# EAGLE design PowerBlock (EAGLE 5.10)
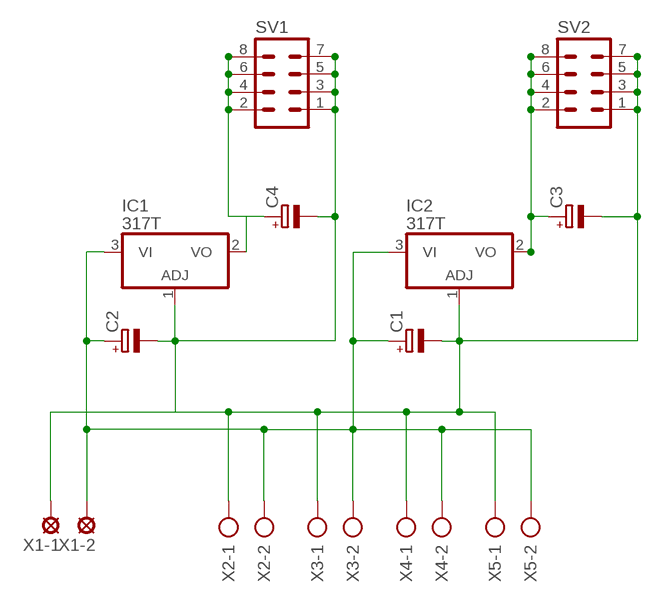
[diagram p0: schematic, sheet 1]

## Parts
C1  CPOL-EUE3.5-8  [E3,5-8]
C2  CPOL-EUE3.5-8  [E3,5-8]
C3  CPOL-EUE2.5-6  [E2,5-6]
C4  CPOL-EUE2.5-6  [E2,5-6]
IC1  317T  [TO220H]
IC2  317T  [TO220H]
SV1  MA04-2  [MA04-2]
SV2  MA04-2  [MA04-2]
X1-1  SE14  [SE14]
X1-2  SE14  [SE14]
X2  AK500/2  [AK500/2]
X3  AK500/2  [AK500/2]
X4  AK500/2  [AK500/2]
X5  AK500/2  [AK500/2]

## Nets
GND: C1.- C2.- C3.- C4.- IC1.1(ADJ) IC2.1(ADJ) SV1.1 SV1.3 SV1.5 SV1.7 SV2.1 SV2.3 SV2.5 SV2.7 X1-1.MP X2.1 X3.1 X4.1 X5.1
N$1: C4.+ IC1.2(VO) SV1.2 SV1.4 SV1.6 SV1.8
N$3: C3.+ IC2.2(VO) SV2.2 SV2.4 SV2.6 SV2.8
VCC: C1.+ C2.+ IC1.3(VI) IC2.3(VI) X1-2.MP X2.2 X3.2 X4.2 X5.2

## Library data of the parts
C1-C4 = rcl:CPOL-EU: POLARIZED CAPACITOR, European symbol
IC1 IC2 = linear:*317: Positive VOLTAGE REGULATOR
SV1 SV2 = con-lstb:MA04-2: PIN HEADER
X1-1 X1-2 = solpad:SE14: SOLDER PAD E1553, drill 1,4mm, distributor Buerklin, 07F820
X2-X5 = con-ptr500:AK500/2: CONNECTOR

## Board
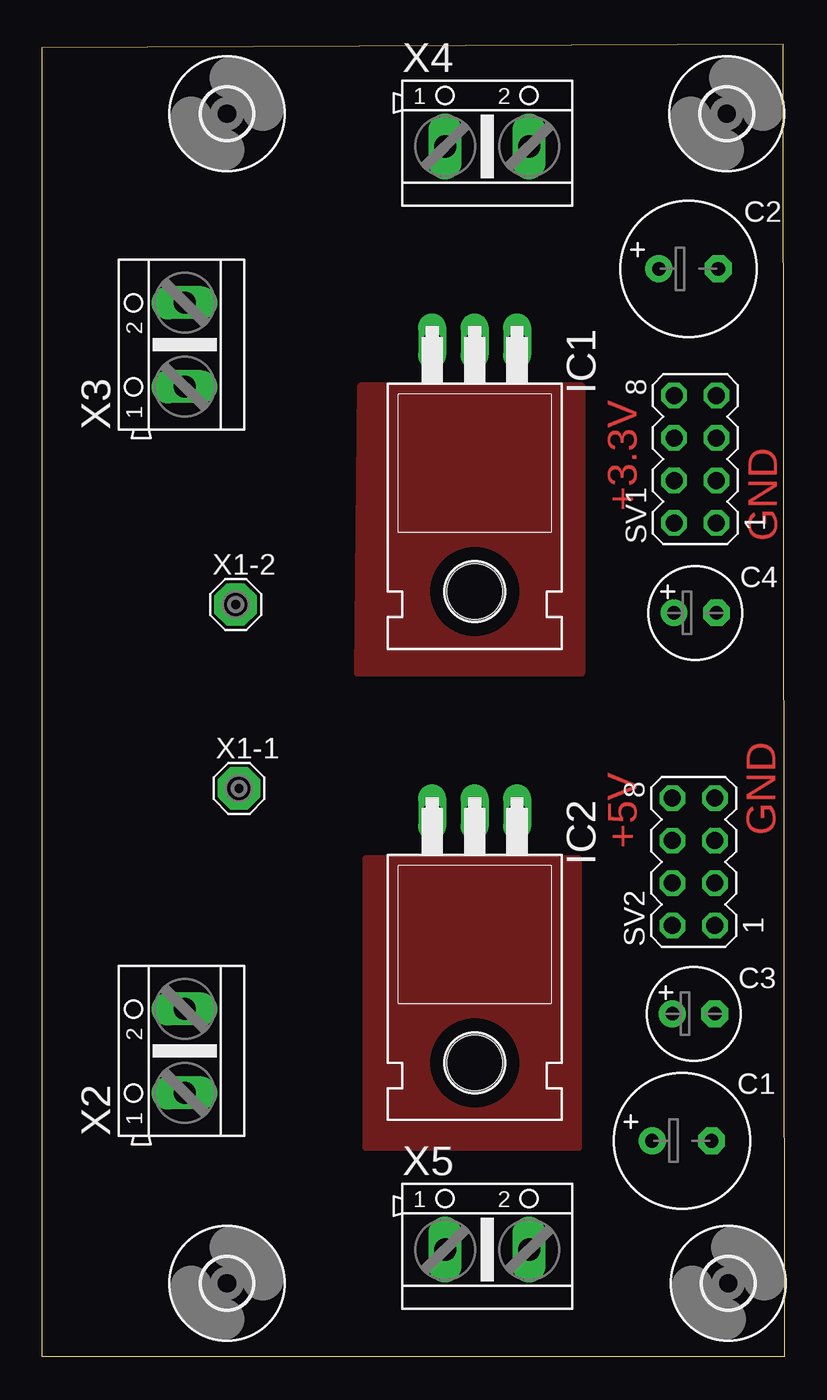
[diagram p1: board, top side]
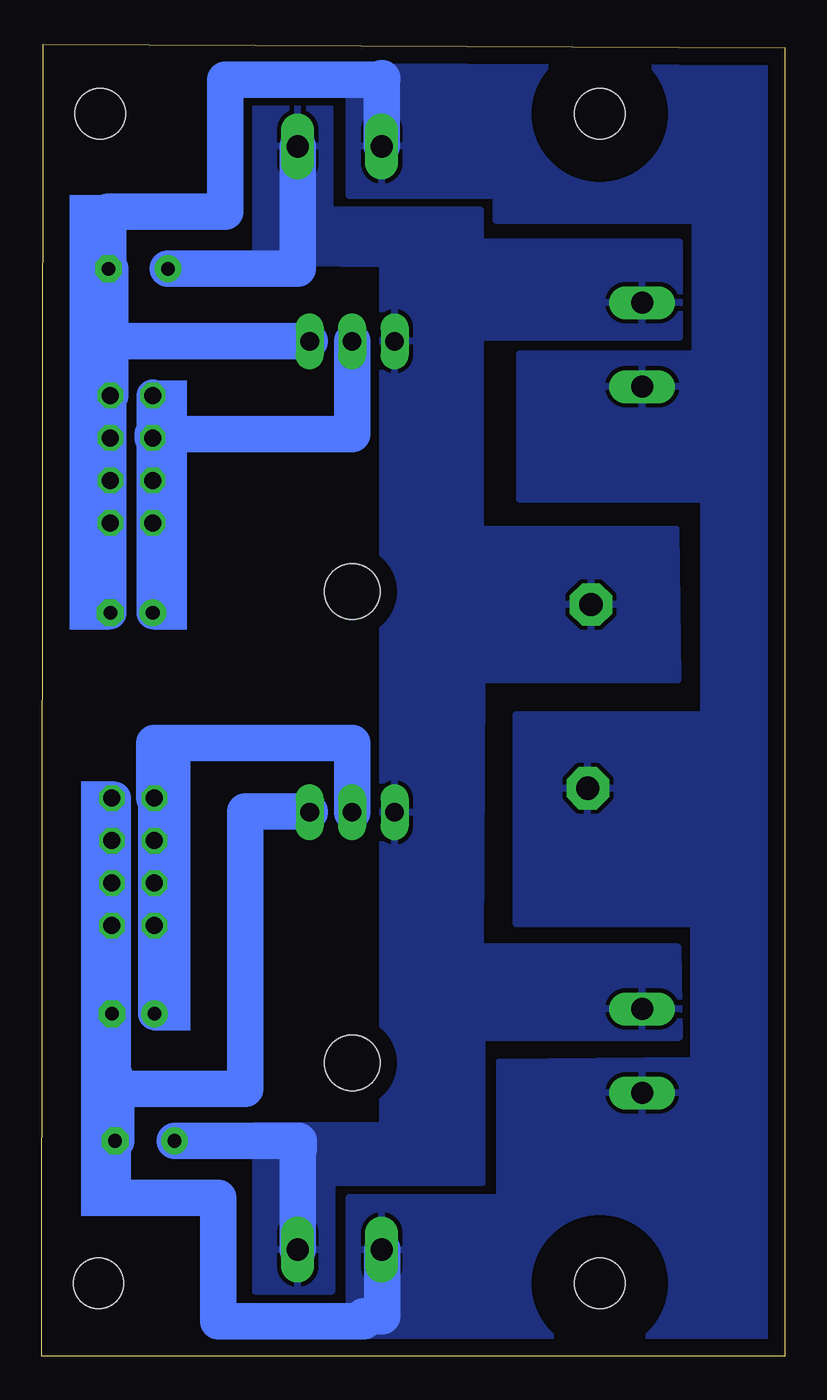
[diagram p2: board, bottom side, seen from below]

Size 44.47 x 78.54 mm. Coordinates in mm from the lower left corner, seen from the top.
Outline: 0,0 44.47,0 44.37,78.54 0,78.34 0,0
Copper layers (1*16): Top 0.035mm / dielectric 1.5mm / Bottom 0.035mm
Design rules "default": minimum track width 20mil, minimum drill 32mil, track to track 16mil, track to pad 16mil, pad to pad 16mil, via to via 16mil, smd to smd 12mil, copper to edge 40mil, drill to drill 40mil, minimum pad ring 10mil, minimum via ring 8mil, stop-mask expansion 4mil, vias tented up to drill 0mil, thermal gap 10mil

### Footprints (pad centres in the part's own frame; a part is rotated, then mirrored left to right if it is on the bottom)
E3,5-8 = drill 0.813 pad 1.6 round: + -1.778,0 | drill 0.813 pad 1.6 octagon: - 1.778,0
E2,5-6 = drill 0.813 pad 1.6 round: + -1.27,0 | drill 0.813 pad 1.6 octagon: - 1.27,0
TO220H = drill 1.118 long: 1 -2.54,-10.16; 2 0,-10.16; 3 2.54,-10.16 | hole 3.302: 0,4.826
MA04-2 = drill 1.016 octagon: 1 -3.81,-1.27; 2 -3.81,1.27; 3 -1.27,-1.27; 4 -1.27,1.27; 5 1.27,-1.27; 6 1.27,1.27; 7 3.81,-1.27; 8 3.81,1.27
3,0 = hole 3: 0,0
SE14 = drill 1.397 pad 2.54 octagon: MP 0,0
AK500/2 = drill 1.321 long: 1 -2.515,0; 2 2.515,0

### Placement (x,y rotation side)
C1  38.3,12.9 0 top
C2  38.7,65.1 0 top
C3  39,20.5 0 top
C4  39.1,44.5 0 top
IC1  25.9,50.6 180 top
IC2  25.9,22.4 180 top
SV1  39.1,53.7 90 top
SV2  39,29.6 90 top
U$1  [3,0]  11.08,4.38 0 top
U$2  [3,0]  41.08,4.38 0 top
U$3  [3,0]  11.08,74.38 0 top
U$4  [3,0]  40.98,74.38 0 top
X1-1  11.8,34 0 top
X1-2  11.6,45 0 top
X2  8.55,18.28 90 top
X3  8.55,60.55 90 top
X4  26.65,72.42 0 top
X5  26.65,6.39 0 top

### Tracks (layer width: path | path; a pad name or v marks a point on that pad's centre or on a via)
GND
  Bottom 1.93: 40,16 40,16.9 40.2,16.9 40.2,20.5 C3.- SV2.1 SV2.3 SV2.5 SV2.7 40.1,33.41 40.1,9.5 | C4.- SV1.1 SV1.3 SV1.5 SV1.7
  Bottom 2.184: X4.1 24.13,76.5 24.1,76.5 24.1,76.4 33.5,76.4 33.5,68.5 40.48,68.5 C2.- 40.37,65.1 40.37,60.76 | C1.- 40,12.9 40,16 32.3,16 32.3,32.6 28.44,32.6 IC2.1 | SV1.7 40.37,60.76 | 40.37,60.76 IC1.1 | 40.1,9.5 33.9,9.5 33.9,2.1 25.2,2.1 25.2,2.4 24.1,2.4 24.1,6.4
  pour Bottom: 17.1,9.5 26.1,9.5 26.1,0.8 0.6,1.1 0.6,77.6 26.1,77.6 26.1,69.5 17.3,69.5 17.3,68 5.4,68 5.4,60 15.9,60 15.9,51.3 4.9,51.3 4.9,38.4 16.1,38.4 16.1,25.9 5.5,25.9 5.5,17.7 17.1,17.6
N$1
  Bottom 1.93: C4.+ SV1.2 SV1.4 SV1.6 SV1.8
  Bottom 2.184: IC1.2 25.9,55.2 37.83,55.2 SV1.6
N$2
  pour Top: 19.1,58.1 32.3,58.1 32.3,40.9 18.9,40.9
N$3
  Bottom 1.93: SV2.8 SV2.6 SV2.4 SV2.2 C3.+
  Bottom 2.184: IC2.2 25.9,36.7 37.73,36.7 SV2.8
N$4  (via drill 0.6 pad 1.27)
  other vias: 11.1,74.4
N$5  (via drill 0.6 pad 1.27)
  other vias: 41,74.4
N$6  (via drill 0.6 pad 1.27)
  other vias: 41.1,4.4
N$7  (via drill 0.6 pad 1.27)
  other vias: 11.1,4.4
S$1
  pour Top: 19.4,29.8 32.1,29.8 32.1,12.5 19.4,12.5
VCC
  Bottom 2.184: C1.+ 29.1,12.9 29.1,12.4 29.16,12.4 X5.2 | C2.+ 29.16,65.1 X4.2
  pour Bottom: 31.7,3.9 27.1,3.9 27.1,10.4 18.1,10.4 18.1,19.1 6.3,19.1 6.4,24.5 18.2,24.5 18.1,40.5 6.4,40.5 6.5,49.5 18.2,49.5 18.2,61 6.3,61 6.3,66.7 18.2,66.7 18.2,68.6 27.2,68.6 27.2,74.7 31.7,74.7 31.7,65.5 24.1,65.4 24.1,13.8 31.7,13.8
(copper drawn outside any net)
  shapes: Bottom area x4

### Text on the board
Top: +3.3V | GND | +5V | GND